# Altium schematic sheet WBoard.SchDoc: Placa Sensores Wireless
size A4; Author: Grupo 5 - Proyecto Final; DrawnBy: Bruno Valinoti; ProjectName: Controlador de luces MIDI
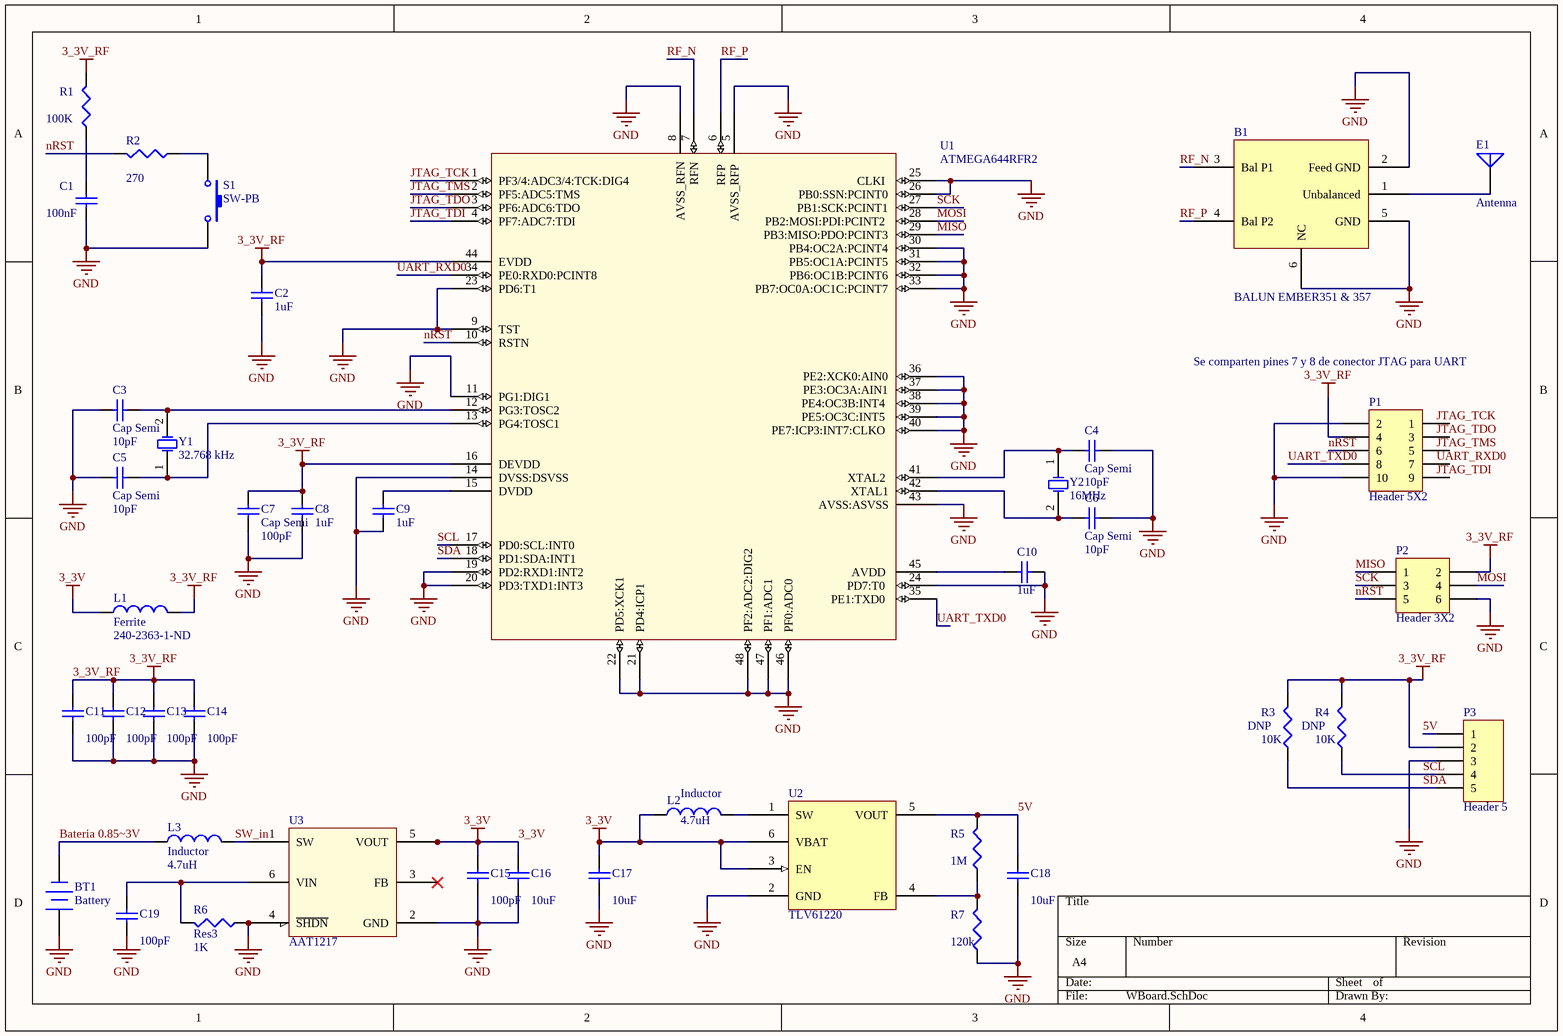
[diagram p0: WBoard.SchDoc]

## Parts
B1  BALUN EMBER351 & 357
BT1  Battery  [BAT-2]
C1  value 100nF  [C1206]  (hidden comment: Cap Semi)
C2  value 1uF  [C1206]  (hidden comment: Cap Semi)
C3  Cap Semi  value 10pF  [1608[0603]]
C4  Cap Semi  value 10pF  [1608[0603]]
C5  Cap Semi  value 10pF  [1608[0603]]
C6  Cap Semi  value 10pF  [1608[0603]]
C7  Cap Semi  value 100pF  [1608[0603]]
C8  value 1uF  [C1206]  (hidden comment: Cap Semi)
C9  value 1uF  [C1206]  (hidden comment: Cap Semi)
C10  value 1uF  [C1206]  (hidden comment: Cap Semi)
C11  value 100pF  [1608[0603]]  (hidden comment: Cap Semi)
C12  value 100pF  [1608[0603]]  (hidden comment: Cap Semi)
C13  value 100pF  [1608[0603]]  (hidden comment: Cap Semi)
C14  value 100pF  [1608[0603]]  (hidden comment: Cap Semi)
C15  value 100pF  [1608[0603]]  (hidden comment: Cap Semi)
C16  value 10uF  [1608[0603]]  (hidden comment: Cap Semi)
C17  value 10uF  [1608[0603]]  (hidden comment: Cap Semi)
C18  value 10uF  [1608[0603]]  (hidden comment: Cap Semi)
C19  value 100pF  [1608[0603]]  (hidden comment: Cap Semi)
E1  Antenna  [PIN1]
L1  Ferrite  value 240-2363-1-ND  [0402-A]
L2  Inductor  value 4.7uH  [0402-A]
L3  Inductor  value 4.7uH  [0402-A]
P1  Header 5X2  [HDR2X5]
P2  Header 3X2  [HDR2X3]
P3  Header 5  [HDR1X5]
R1  value 100K  [J1-0603]  (hidden comment: Res3)
R2  value 270  [J1-0603]  (hidden comment: Res3)
R3  DNP  value 10K  [J1-0603]
R4  DNP  value 10K  [J1-0603]
R5  value 1M  [J1-0603]  (hidden comment: Res3)
R6  Res3  value 1K  [J1-0603]
R7  value 120k  [J1-0603]  (hidden comment: Res3)
S1  SW-PB  [SPST-2]
U1  ATMEGA644RFR2  [QFN50P700X700-48V4M]
U2  TLV61220  [SOT26A-6N]
U3  AAT1217  [SOT26A-6AL]
Y1  32.768 kHz  [R38]
Y2  16MHz  [R38]

## Nets
3_3V: C15.2 C16.2 C17.2 L1.1 L2.1 U2.3(EN) U2.6(VBAT) U3.5(VOUT)
3_3V_RF: C2.1 C7.2 C8.1 C11.2 C12.2 C13.2 C14.2 L1.2 P1.4 P2.2 P3.2 R1.2 R3.2 R4.2 U1.16(DEVDD) U1.44(EVDD)
GND: B1.2(Feed_GND) B1.5(GND) B1.6(NC) BT1.1(+) C1.2 C2.2 C3.1 C4.1 C5.1 C6.1 C7.1 C8.2 C9.2 C10.2 C11.1 C12.1 C13.1 C14.1 C15.1 C16.1 C17.1 C18.1 C19.1 P1.2 P1.10 P2.6 P3.3 R6.1 R7.1 S1.2 U1.5(AVSS_RFP) U1.8(AVSS_RFN) U1.9(TST) U1.11(PG1:DIG1) U1.14(DVSS:DSVSS) U1.19(PD2:RXD1:INT2) U1.20(PD3:TXD1:INT3) U1.21(PD4:ICP1) U1.22(PD5:XCK1) U1.23(PD6:T1) U1.24(PD7:T0) U1.25(CLKI) U1.26(PB0:SSN:PCINT0) U1.30(PB4:OC2A:PCINT4) U1.31(PB5:OC1A:PCINT5) U1.32(PB6:OC1B:PCINT6) U1.33(PB7:OC0A:OC1C:PCINT7) U1.36(PE2:XCK0:AIN0) U1.37(PE3:OC3A:AIN1) U1.38(PE4:OC3B:INT4) U1.39(PE5:OC3C:INT5) U1.40(PE7:ICP3:INT7:CLKO) U1.43(AVSS:ASVSS) U1.46(PF0:ADC0) U1.47(PF1:ADC1) U1.48(PF2:ADC2:DIG2) U2.2(GND) U3.2(GND) U3.4(~{SHDN})
5V: C18.2 P3.1 R5.2 U2.5(VOUT)
Bateria 0.85~3V: BT1.2(-) L3.1
JTAG_TCK: U1.1(PF3/4:ADC3/4:TCK:DIG4)
JTAG_TDI: U1.4(PF7:ADC7:TDI)
JTAG_TDO: U1.3(PF6:ADC6:TDO)
JTAG_TMS: U1.2(PF5:ADC5:TMS)
MISO: P2.1 U1.29(PB3:MISO:PDO:PCINT3)
MOSI: P2.4 U1.28(PB2:MOSI:PDI:PCINT2)
nRST: P1.6 P2.5 R2.2 U1.10(RSTN)
RF_N: B1.3(Bal_P1) U1.7(RFN)
RF_P: B1.4(Bal_P2) U1.6(RFP)
SCK: P2.3 U1.27(PB1:SCK:PCINT1)
SCL: P3.4 R4.1 U1.17(PD0:SCL:INT0)
SDA: P3.5 R3.1 U1.18(PD1:SDA:INT1)
SW_in: L3.2 U3.1(SW)
UART_RXD0: U1.34(PE0:RXD0:PCINT8)
UART_TXD0: P1.8 U1.35(PE1:TXD0)
NetB1_1: B1.1(Unbalanced) E1.1(A)
NetC1_1: C1.1 R1.1
NetC3_2: C3.2 U1.12(PG3:TOSC2) Y1.2(OSC2)
NetC4_2: C4.2 U1.41(XTAL2) Y2.1(OSC1)
NetC5_2: C5.2 U1.13(PG4:TOSC1) Y1.1(OSC1)
NetC6_2: C6.2 U1.42(XTAL1) Y2.2(OSC2)
NetC9_1: C9.1 U1.15(DVDD)
NetC10_1: C10.1 U1.45(AVDD)
NetC19_2: C19.2 R6.2 U3.6(VIN)
NetL2_2: L2.2 U2.1(SW)
NetR2_1: R2.1 S1.1
NetR5_1: R5.1 R7.2 U2.4(FB)

Not connected (* = marked no-connect by the designer): P1 1 3 5 7 9; U3 3(FB)*

## Notes on the sheet
- Se comparten pines 7 y 8 de conector JTAG para UART
- Labels drawn without touching a wire or pin: JTAG_TCK, JTAG_TDI, JTAG_TDO, JTAG_TMS, UART_RXD0

## Library data of the parts
BT1 = Battery: Multicell Battery; Published: 24-Mar-1999; LatestRevisionDate: 17-Jul-2002; LatestRevisionNote: Re-released for DXP Platform.; PackageReference: BAT-2; Publisher: Altium Limited; PackageDescription: Battery; 2 Leads
C1-C19 = Cap Semi: Capacitor (Semiconductor SIM Model); Published: 8-Jun-2000; LatestRevisionDate: 29-May-2009; LatestRevisionNote: IPC-7351 Footprint Added.; PackageReference: C1206; Publisher: Altium Limited; PackageDescription: Chip Capacitor
E1 = Antenna: Generic Antenna; Published: 24-Mar-1999; LatestRevisionDate: 17-Jul-2002; LatestRevisionNote: Re-released for DXP Platform.; PackageReference: PIN1; Publisher: Altium Limited
L1-L3 = Inductor: Code_IEC: 1005; Published: 8-Jun-2000; LatestRevisionDate: 29-May-2009; LatestRevisionNote: IPC-7351 Footprint Added.; PackageReference: 0402-A; Publisher: Altium Limited; PackageDescription: Chip Inductor; Code_JEITA: 0402
P1 = Header 5X2: Header, 5-Pin, Dual row; LatestRevisionDate: 17-Jul-2002; LatestRevisionNote: Re-released for DXP Platform.; Publisher: Altium Limited
P2 = Header 3X2: Header, 3-Pin, Dual row; LatestRevisionDate: 17-Jul-2002; LatestRevisionNote: Re-released for DXP Platform.; Publisher: Altium Limited
P3 = Header 5: Header, 5-Pin; LatestRevisionDate: 17-Jul-2002; LatestRevisionNote: Re-released for DXP Platform.; Publisher: Altium Limited
R1-R7 = Res3: Resistor; Published: 8-Jun-2000; LatestRevisionDate: 29-May-2009; LatestRevisionNote: IPC-7351 Footprint Added.; PackageReference: J1-0603; Publisher: Altium Limited; PackageDescription: Chip Resistor
S1 = SW-PB: Switch; Published: 24-Mar-1999; LatestRevisionDate: 17-Jul-2002; LatestRevisionNote: Re-released for DXP Platform.; PackageReference: SPST-2; Publisher: Altium Limited; PackageDescription: Switch; 2 Leads
U2 = TLV61220: LOW INPUT VOLTAGE STEP-UP CONVERTER IN THIN SOT-23 PACKAGE
Y1 Y2 = XTAL: Crystal Oscillator; Published: 8-Jun-2000; LatestRevisionDate: 17-Jul-2002; LatestRevisionNote: Re-released for DXP Platform.; PackageReference: R38; Publisher: Altium Limited; PackageDescription: Crystal, Thru-Hole; 2 Leads; Body 3.1 x 8.2 mm (Dia.xH)